# Altium schematic sheet decoupling.SchDoc: foxBMS BMS-Slave 12-Cell
size A3; DocumentNumber: 12; SheetNumber: 12; SheetTotal: 21; AUTHOR: Fraunhofer IISB foxBMS Team; SheetDescription: Primary Voltage Measurement
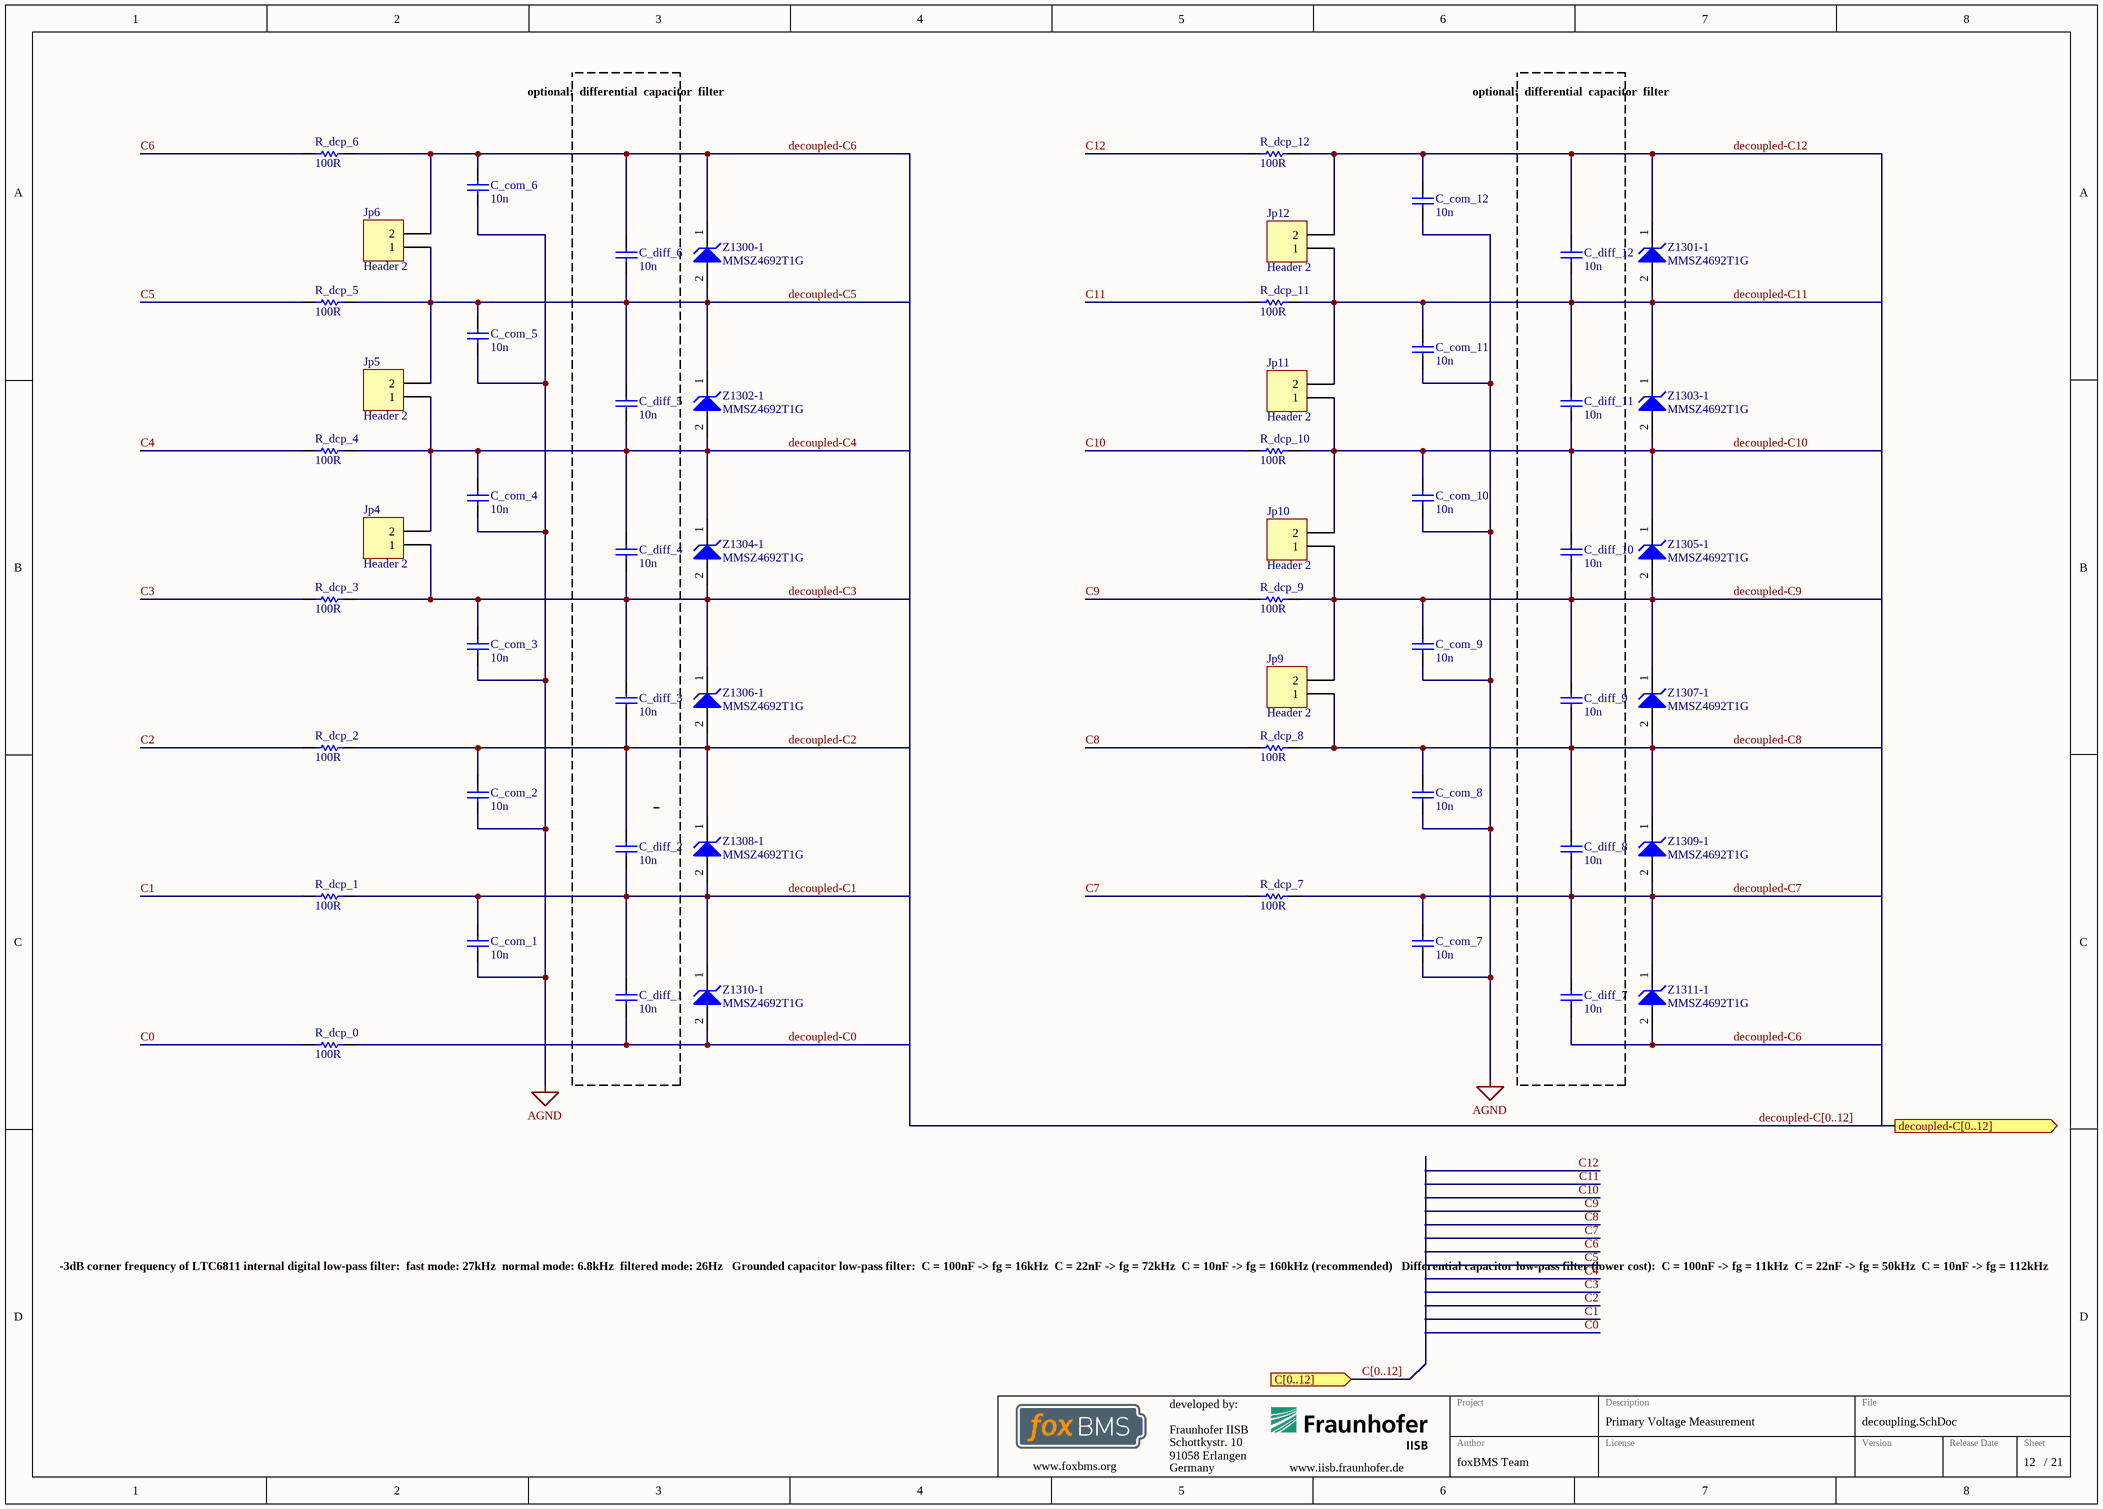
[diagram p0: decoupling.SchDoc]

## Parts
C_com_1  10n  [CAPC0603(1608)55_N]
C_com_2  10n  [CAPC0603(1608)55_N]
C_com_3  10n  [CAPC0603(1608)55_N]
C_com_4  10n  [CAPC0603(1608)55_N]
C_com_5  10n  [CAPC0603(1608)55_N]
C_com_6  10n  [CAPC0603(1608)55_N]
C_com_7  10n  [CAPC0603(1608)55_N]
C_com_8  10n  [CAPC0603(1608)55_N]
C_com_9  10n  [CAPC0603(1608)55_N]
C_com_10  10n  [CAPC0603(1608)55_N]
C_com_11  10n  [CAPC0603(1608)55_N]
C_com_12  10n  [CAPC0603(1608)55_N]
C_diff_1  10n  [CAPC0603(1608)55_N]
C_diff_2  10n  [CAPC0603(1608)55_N]
C_diff_3  10n  [CAPC0603(1608)55_N]
C_diff_4  10n  [CAPC0603(1608)55_N]
C_diff_5  10n  [CAPC0603(1608)55_N]
C_diff_6  10n  [CAPC0603(1608)55_N]
C_diff_7  10n  [CAPC0603(1608)55_N]
C_diff_8  10n  [CAPC0603(1608)55_N]
C_diff_9  10n  [CAPC0603(1608)55_N]
C_diff_10  10n  [CAPC0603(1608)55_N]
C_diff_11  10n  [CAPC0603(1608)55_N]
C_diff_12  10n  [CAPC0603(1608)55_N]
Jp4  Header 2  [HDR1X2]
Jp5  Header 2  [HDR1X2]
Jp6  Header 2  [HDR1X2]
Jp9  Header 2  [HDR1X2]
Jp10  Header 2  [HDR1X2]
Jp11  Header 2  [HDR1X2]
Jp12  Header 2  [HDR1X2]
R_dcp_0  100R  [RESC0603(1608)_N]
R_dcp_1  100R  [RESC0603(1608)_N]
R_dcp_2  100R  [RESC0603(1608)_N]
R_dcp_3  100R  [RESC0603(1608)_N]
R_dcp_4  100R  [RESC0603(1608)_N]
R_dcp_5  100R  [RESC0603(1608)_N]
R_dcp_6  100R  [RESC0603(1608)_N]
R_dcp_7  100R  [RESC0603(1608)_N]
R_dcp_8  100R  [RESC0603(1608)_N]
R_dcp_9  100R  [RESC0603(1608)_N]
R_dcp_10  100R  [RESC0603(1608)_N]
R_dcp_11  100R  [RESC0603(1608)_N]
R_dcp_12  100R  [RESC0603(1608)_N]
Z1300-1  MMSZ4692T1G  [ONSC-SOD-123-2-425-04_V]
Z1301-1  MMSZ4692T1G  [ONSC-SOD-123-2-425-04_V]
Z1302-1  MMSZ4692T1G  [ONSC-SOD-123-2-425-04_V]
Z1303-1  MMSZ4692T1G  [ONSC-SOD-123-2-425-04_V]
Z1304-1  MMSZ4692T1G  [ONSC-SOD-123-2-425-04_V]
Z1305-1  MMSZ4692T1G  [ONSC-SOD-123-2-425-04_V]
Z1306-1  MMSZ4692T1G  [ONSC-SOD-123-2-425-04_V]
Z1307-1  MMSZ4692T1G  [ONSC-SOD-123-2-425-04_V]
Z1308-1  MMSZ4692T1G  [ONSC-SOD-123-2-425-04_V]
Z1309-1  MMSZ4692T1G  [ONSC-SOD-123-2-425-04_V]
Z1310-1  MMSZ4692T1G  [ONSC-SOD-123-2-425-04_V]
Z1311-1  MMSZ4692T1G  [ONSC-SOD-123-2-425-04_V]

## Blocks framed on the sheet
optional: / differential / capacitor / filter: C_diff_1-C_diff_6
optional: / differential / capacitor / filter: C_diff_7-C_diff_12

## Ports
C[0..12] (in), decoupled-C[0..12] (out)

## Nets
AGND: C_com_1.1 C_com_2.1 C_com_3.1 C_com_4.1 C_com_5.2 C_com_6.2 C_com_7.1 C_com_8.1 C_com_9.1 C_com_10.1 C_com_11.1 C_com_12.1
C0: R_dcp_0.1
C1: R_dcp_1.1
C2: R_dcp_2.1
C3: R_dcp_3.1
C4: R_dcp_4.1
C5: R_dcp_5.1
C6: R_dcp_6.1
C7: R_dcp_7.1
C8: R_dcp_8.1
C9: R_dcp_9.1
C10: R_dcp_10.1
C11: R_dcp_11.1
C12: R_dcp_12.1
decoupled-C0: C_diff_1.1 R_dcp_0.2 Z1310-1.2(A)
decoupled-C1: C_com_1.2 C_diff_1.2 C_diff_2.1 R_dcp_1.2 Z1308-1.2(A) Z1310-1.1(K)
decoupled-C2: C_com_2.2 C_diff_2.2 C_diff_3.1 R_dcp_2.2 Z1306-1.2(A) Z1308-1.1(K)
decoupled-C3: C_com_3.2 C_diff_3.2 C_diff_4.1 Jp4.1 R_dcp_3.2 Z1304-1.2(A) Z1306-1.1(K)
decoupled-C4: C_com_4.2 C_diff_4.2 C_diff_5.1 Jp4.2 Jp5.1 R_dcp_4.2 Z1302-1.2(A) Z1304-1.1(K)
decoupled-C5: C_com_5.1 C_diff_5.2 C_diff_6.1 Jp5.2 Jp6.1 R_dcp_5.2 Z1300-1.2(A) Z1302-1.1(K)
decoupled-C6: C_com_6.1 C_diff_6.2 C_diff_7.1 Jp6.2 R_dcp_6.2 Z1300-1.1(K) Z1311-1.2(A)
decoupled-C7: C_com_7.2 C_diff_7.2 C_diff_8.1 R_dcp_7.2 Z1309-1.2(A) Z1311-1.1(K)
decoupled-C8: C_com_8.2 C_diff_8.2 C_diff_9.1 Jp9.1 R_dcp_8.2 Z1307-1.2(A) Z1309-1.1(K)
decoupled-C9: C_com_9.2 C_diff_9.2 C_diff_10.1 Jp9.2 Jp10.1 R_dcp_9.2 Z1305-1.2(A) Z1307-1.1(K)
decoupled-C10: C_com_10.2 C_diff_10.2 C_diff_11.1 Jp10.2 Jp11.1 R_dcp_10.2 Z1303-1.2(A) Z1305-1.1(K)
decoupled-C11: C_com_11.2 C_diff_11.2 C_diff_12.1 Jp11.2 Jp12.1 R_dcp_11.2 Z1301-1.2(A) Z1303-1.1(K)
decoupled-C12: C_com_12.2 C_diff_12.2 Jp12.2 R_dcp_12.2 Z1301-1.1(K)

## Buses and harness runs
bus C[0..12] = port C[0..12]
bus decoupled-C[0..12] = port decoupled-C[0..12]

## Notes on the sheet
- -3dB corner frequency of LTC6811 internal digital low-pass filter:
  fast mode: 27kHz
  normal mode: 6.8kHz
  filtered mode: 26Hz
  Grounded capacitor low-pass filter:
  C = 100nF -> fg = 16kHz
  C = 22nF -> fg = 72kHz
  C = 10nF -> fg = 160kHz (recommended)
  Differential capacitor low-pass filter (lower cost):
  C = 100nF -> fg = 11kHz
  C = 22nF -> fg = 50kHz
  C = 10nF -> fg = 112kHz
- Fraunhofer IISB
- Schottkystr. 10
- developed by:
- 91058 Erlangen
- Germany
- Author
- Project
- License
- Description
- File
- Version
- Release Date
- Sheet
- www.foxbms.org
- www.iisb.fraunhofer.de
- foxBMS Team
- /

## Library data of the parts
C_com_1-C_com_12 C_diff_1-C_diff_12 = Cap 10n: Keramikvielschichtkondensator, SMD, Baureihe MC, ± 10%; Manufacturer: TDK; Voltage Rating: 50V; OC_MOUSER: CGA3E2X7R1H103K080AA; Value: 10n; PackageReference: 0603; Tolerance: ± 10%
Jp4-Jp6 Jp9-Jp12 = Header 2: Header, 2-Pin; LatestRevisionDate: 17-Jul-2002; LatestRevisionNote: Re-released for DXP Platform.; Publisher: Altium Limited
R_dcp_0-R_dcp_12 = Res 100R: Chipwiderstand, SMD, Baureihe MC, 1%; Manufacturer: Multicomp; Power: 100mW; PackageReference: 0603; Value: 100R; OC_FARNELL: 2447227
Z1300-1 Z1301-1 Z1302-1 Z1303-1 Z1304-1 Z1305-1 Z1306-1 Z1307-1 Z1308-1 Z1309-1 Z1310-1 Z1311-1 = CMP-1060-00434-1: Zener Voltage Regulator, 500 mW, 2-Pin SOD-123, Pb-Free, Tape and Reel; Manufacturer: On Semiconductor; VZ Typ (V): 6.8; P Max (W): 0.5; ComponentLink2URL: http://www.onsemi.com/pub_link/Collateral/MMSZ4678T1-D.PDF; Mounting Technology: Surface Mount; DatasheetVersion: Rev. 9; ComponentLink1Description: Manufacturer URL; ComponentLink3URL: http://www.onsemi.com/pub_link/Collateral/425-04.PDF; PackageReference: SOD-123-2-425-04; ComponentLink2Description: Datasheet; RoHS: Pb-Free; Packing: Tape and Reel; ComponentLink1URL: http://www.onsemi.com/; PackageDescription: 2-Pin SOD, Body 1.6 x 2.69 mm; ComponentLink3Description: Package Specification; PartNumber: MMSZ4692T1G; PackageVersion: Rev. G, 10/2009